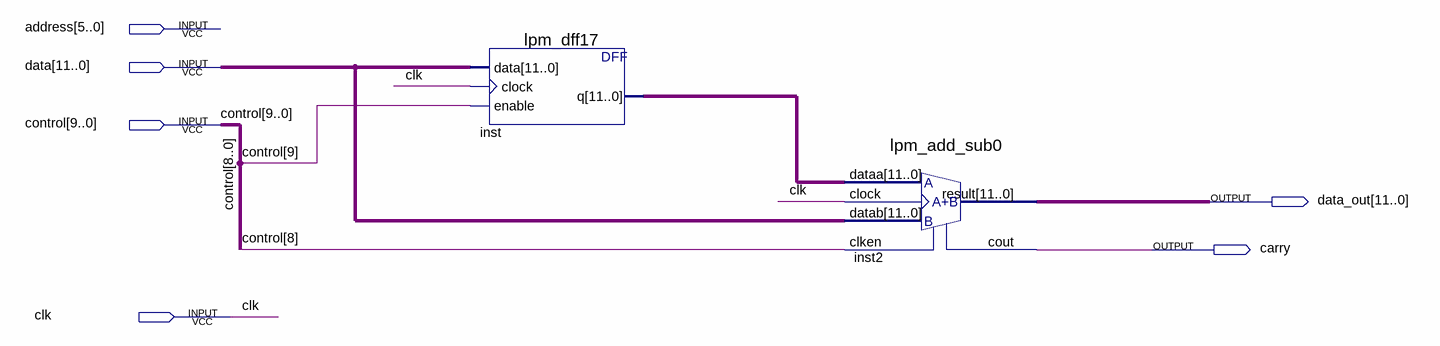
[diagram p0: schematic sheet]
// Quartus schematic ALU.bdf as structural Verilog: 2 symbols, 6 pins
module ALU (
  input  [5:0] address,
  input  [11:0] data,
  input  [9:0] control,
  input  clk,
  output [11:0] data_out,
  output carry
);

  wire [11:0] inst_q;

  lpm_dff17 inst (.data(data), .clock(clk), .enable(control[9]), .q(inst_q));
  lpm_add_sub0 inst2 (.dataa(inst_q), .datab(data), .clock(clk), .clken(control[8]), .result(data_out), .cout(carry));
endmodule
